# Altium schematic sheet PART5_Step_Down_PSU.SchDoc
size A4
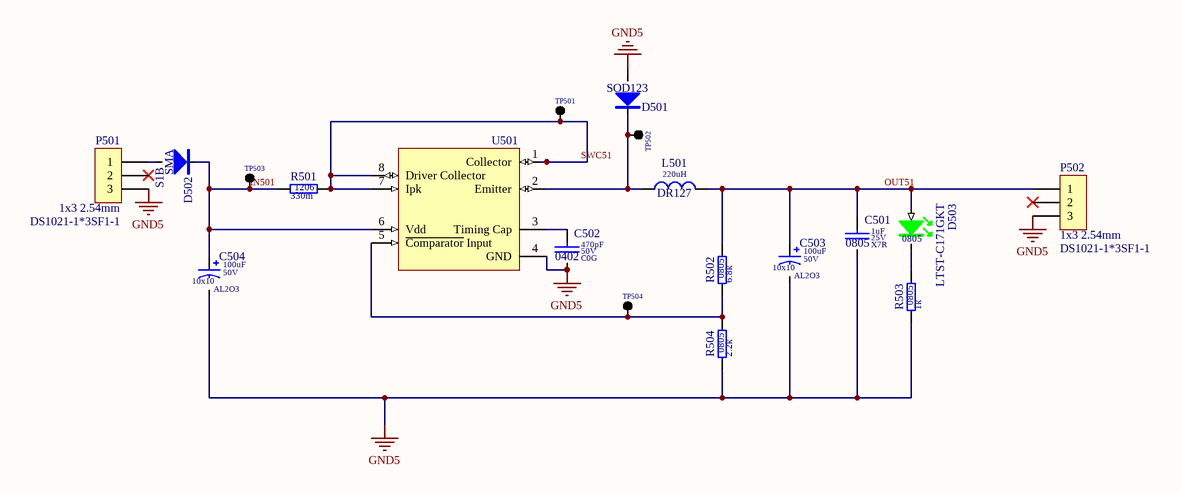
[diagram p0: PART5_Step_Down_PSU.SchDoc]

## Parts
C501  value 1uF  Dielectric: X7R  Voltage: 25V  SCH_Footprint: 0805  [C_0805_2012]  (hidden comment: Ceramic X7R)
C502  value 470pF  Dielectric: C0G  Voltage: 50V  SCH_Footprint: 0402  [C_0402_1005]  (hidden comment: Ceramic C0G)
C503  value 100uF  Dielectric: AL2O3  SCH_Footprint: 10x10  Voltage: 50V  [CE_D_10x10MM]  (hidden comment: Electrolytic Capacitor)
C504  value 100uF  Dielectric: AL2O3  SCH_Footprint: 10x10  Voltage: 50V  [CE_D_10x10MM]  (hidden comment: Electrolytic Capacitor)
D501  1N5819HW  [SOD123]  (value not drawn)
D502  value S1B  SCH_Footprint: SMA  [SMA_DO-214AC]
D503  value LTST-C171GKT  SCH_Footprint: 0805  [OL_0805_2012]  (hidden comment: Green led)
L501  value 220uH  SCH_Footprint: DR127  [L_DR127]  (hidden comment: Inductor)
P501  value DS1021-1*3SF1-1  SCH_Footprint: 1x3 2.54mm  [P_HEADER_1x3_2.54]  (hidden comment: Goldpin)
P502  value DS1021-1*3SF1-1  SCH_Footprint: 1x3 2.54mm  [P_HEADER_1x3_2.54]  (hidden comment: Goldpin)
R501  value 330m  SCH_Footprint: 1206  [R_1206_3216]  (hidden comment: Resistor)
R502  value 6.8k  SCH_Footprint: 0805  [R_0805_2012]  (hidden comment: Resistor)
R503  value 1k  SCH_Footprint: 0805  [R_0805_2012]  (hidden comment: Resistor)
R504  value 2.2k  SCH_Footprint: 0805  [R_0805_2012]  (hidden comment: Resistor)
TP501  Single pin  [TP_1PIN]  (value not drawn)
TP502  Single pin  [TP_1PIN]  (value not drawn)
TP503  Single pin  [TP_1PIN]  (value not drawn)
TP504  Single pin  [TP_1PIN]  (value not drawn)
U501  1.5-A Peak Boost/Buck/Inverting Switching Regulators  [SOP8_SO8_SOIC8_4X5X18]  (value not drawn)

## Nets
GND5: C501.2 C502.2 C503.2 C504.2 D501.2 P501.3 P502.3 R503.1 R504.1 U501.4(GND)
IN501: C504.1 D502.1 R501.1 TP503.1(TP) U501.6(Vdd)
OUT51: C501.1 C503.1 D503.2(A) L501.2 P502.1 R502.2
SWC51: R501.2 TP501.1(TP) U501.1(Collector) U501.7(Ipk) U501.8(Driver_Collector)
NetC502_1: C502.1 U501.3(Timing_Cap)
NetD501_1: D501.1 L501.1 TP502.1(TP) U501.2(Emitter)
NetD502_2: D502.2 P501.1
NetD503_1: D503.1(K) R503.2
NetR502_1: R502.1 R504.2 TP504.1(TP) U501.5(~{Comparator}_Input)

Not connected (* = marked no-connect by the designer): P501 2*; P502 2*

## Library data of the parts
C501 = C_1uF_25V_X7R_0805_10: Capacitor; Manufacturer: AVX; Manufacturer Part Number: 08053C105KAT2A; Tolerance (%): 10; Part Number: C_1uF_25V_X7R_0805_10; HelpURL: https://www.tme.eu/Document/667fe6e7748c0ed1675574c6bf64b751/AVX_X7R.pdf; Supplier 1: TME; Supplier Part Number 1: 08053C105KAT2A; Supplier 2: RS Components; Supplier Part Number 2: 1351396; Supplier 3: Farnell; Supplier Part Number 3: 1658877; Supplier 4: Mouser; Supplier Part Number 4: 581-08053C105KAT2A; Supplier 5: Digi-Key; Supplier Part Number 5: 478-5030-1-ND
C502 = C_470pF_50V_C0G_0402_5: Capacitor; Manufacturer: AVX; Manufacturer Part Number: 04025A471JAT2A; Tolerance (%): 5; Part Number: C_470pF_50V_C0G_0402_5; HelpURL: http://datasheet.octopart.com/04025A471JAT2A-AVX-datasheet-9883399.pdf; Supplier 1: TME; Supplier 2: RS Components; Supplier Part Number 2: 6983119P; Supplier 3: Farnell; Supplier Part Number 3: 2280781; Supplier 4: Mouser; Supplier Part Number 4: 581-04025A471JAT2A; Supplier 5: Digi-Key; Supplier Part Number 5: 478-7880-1-ND
C503 C504 = CE_100uF_50V_AL2O3_10x10_20: Polarized Capacitor; Manufacturer: Nichicon; Manufacturer Part Number: UUX1H101MNL1GS; Tolerance (%): 20; Part Number: CE_100uF_50V_AL2O3_10x10_20; HelpURL: https://datasheet.octopart.com/UUX1H101MNL1GS-Nichicon-datasheet-62047998.pdf; Supplier 1: TME; Supplier Part Number 1: UUX1H101MNL1GS; Supplier 2: RS Components; Supplier Part Number 2: 739-3107; Supplier 3: Farnell; Supplier Part Number 3: 2841943; Supplier 4: Mouser; Supplier Part Number 4: 647-UUX1H101MNL1GS; Supplier 5: Digi-Key; Supplier Part Number 5: 493-6269-1-ND
D501 = D_1N5819HW_1A_40V_SOD123: Voltage: 40V; Current: 1A; SCH_Footprint: SOD123; Part Number: D_1N5819HW_1A_40V_SOD123; Supplier 1: TME; Supplier 2: RS Components; Supplier 3: Farnell; Supplier 4: Mouser; Supplier 5: Digi-Key
D502 = D_S1B_1A_100V_SMA: Manufacturer: Vishay/General Semiconductor; Voltage: 100V; Current: 1A; Part Number: D_S1B_1A_100V_SMA; Manufacturer Part Number: S1B; Supplier 1: TME; Supplier 2: RS Components; Supplier 3: Farnell; Supplier 4: Mouser; Supplier Part Number 4: 821-S1B; Supplier 5: Digi-Key; Supplier Part Number 5: S1B/51GI
D503 = OL_G_0805_0C006_LTST-C171GKT: LED GREEN; Manufacturer: Lite-On; Part Number: OL_G_0805_0C006_LTST-C171GKT; HelpURL: http://datasheet.octopart.com/LTST-C171GKT-Lite-On-datasheet-158474.pdf; Manufacturer Part Number: LTST-C171GKT; Supplier 1: TME; Supplier Part Number 1: LTST-C171GKT; Supplier 2: RS Components; Supplier Part Number 2: 6920935; Supplier 3: Farnell; Supplier 4: Mouser; Supplier Part Number 4: 859-LTST-C171GKT; Supplier 5: Digi-Key; Supplier Part Number 5: 160-1423-1-ND
L501 = L_220uH_1.29A_DR127: Induction; Manufacturer: Eaton; Manufacturer Part Number: DR127-221-R; Current: 1.29A; Resistance: 376mR; Part Number: L_220uH_1.29A_DR127; HelpURL: https://datasheet.octopart.com/DR127-221-R-Eaton-datasheet-552538.pdf; Supplier 1: TME; Supplier 2: RS Components; Supplier Part Number 2: 7701028; Supplier 3: Farnell; Supplier Part Number 3: 2369123; Supplier 4: Mouser; Supplier Part Number 4: 704-DR127-221-R; Supplier 5: Digi-Key; Supplier Part Number 5: 513-1045-1-ND
P501 P502 = P_HEADER_1x3_2.54: Pin Header; Manufacturer: Connfly; Part Number: P_HEADER_1x3_2.54; Component Type: Standard; HelpURL: http://www.tme.eu/en/Document/cc301e58a5da78cb543a94b5a5b7f06a/DS1021.pdf; Manufacturer Part Number: DS1021-1*3SF1-1; Supplier 1: TME; Supplier Part Number 1: ZL201-03G; Supplier 2: RS Components; Supplier 3: Farnell; Supplier 4: Mouser; Supplier 5: Digi-Key
R501 = R_330m_1206_1: Manufacturer: Panasonic; Manufacturer Part Number: ERJ-8RQFR33V; Voltage: 256mV; Power: 250mW; Tolerance: 1%; Part Number: R_330m_1206_1; HelpURL: https://pl.mouser.com/datasheet/2/315/AOA0000C313-1141758.pdf; Supplier 1: TME; Supplier 2: RS Components; Supplier Part Number 2: 721-5754; Supplier 3: Farnell; Supplier Part Number 3: 1717846; Supplier 4: Mouser; Supplier Part Number 4: 667-ERJ-8RQFR33V; Supplier 5: Digi-Key; Supplier Part Number 5: P.33RCT-ND
R502 = R_6.8k_0805_1: Manufacturer: Royalohm; Manufacturer Part Number: HP05W3F6801T5E; Voltage: 150V; Power: 300mW; Tolerance: 1%; Part Number: R_6.8k_0805_1; HelpURL: https://www.tme.eu/pl/Document/fa390a0a31e891a154d3713216995c6e/HighPowerHP.pdf; Supplier 1: TME; Supplier Part Number 1: HP05-6K81%; Supplier 2: RS Components; Supplier 3: Farnell; Supplier 4: Mouser; Supplier 5: Digi-Key
R503 = R_1k_0805_1: Manufacturer: Royalohm; Manufacturer Part Number: HP05W3F1001T5E; Voltage: 150V; Power: 300mW; Tolerance: 1%; Part Number: R_1k_0805_1; HelpURL: https://www.tme.eu/pl/Document/63d5a2fbb689d2d511047d7cc8640cd8/chip_resistor_hp.pdf; Supplier 1: TME; Supplier Part Number 1: HP05-1K1%; Supplier 2: RS Components; Supplier 3: Farnell; Supplier 4: Mouser; Supplier 5: Digi-Key
R504 = R_2.2k_0805_1: Manufacturer: Royalohm; Manufacturer Part Number: HP05W3F2201T5E; Voltage: 150V; Power: 300mW; Tolerance: 1%; Part Number: R_2.2k_0805_1; HelpURL: https://www.tme.eu/pl/Document/fa390a0a31e891a154d3713216995c6e/HighPowerHP.pdf; Supplier 1: TME; Supplier Part Number 1: HP05-2K21%; Supplier 2: RS Components; Supplier 3: Farnell; Supplier 4: Mouser; Supplier 5: Digi-Key
TP501-TP504 = TP_1PIN: Testpoint; SCH_Footprint: Single; Part Number: TP_1PIN; Component Type: Standard; Supplier 1: TME; Supplier 2: RS Components; Supplier 3: Farnell; Supplier 4: Mouser; Supplier 5: Digi-Key
U501 = U_MC34063AD: Manufacturer: Texas Instruments; SCH_Footprint: SOIC8; Value: MC34063AD; Part Number: U_MC34063AD; HelpURL: https://www.ti.com/lit/ds/symlink/mc34063a.pdf?ts=1594733387223; Manufacturer Part Number: MC34063AD; Supplier 1: TME; Supplier 2: RS Components; Supplier Part Number 2: 661-8436; Supplier 3: Farnell; Supplier Part Number 3: 3007277; Supplier 4: Mouser; Supplier Part Number 4: 595-MC34063AD; Supplier 5: Digi-Key